# Altium schematic sheet 6V_buck.SchDoc
size A4; SheetNumber: 3; SheetTotal: 3
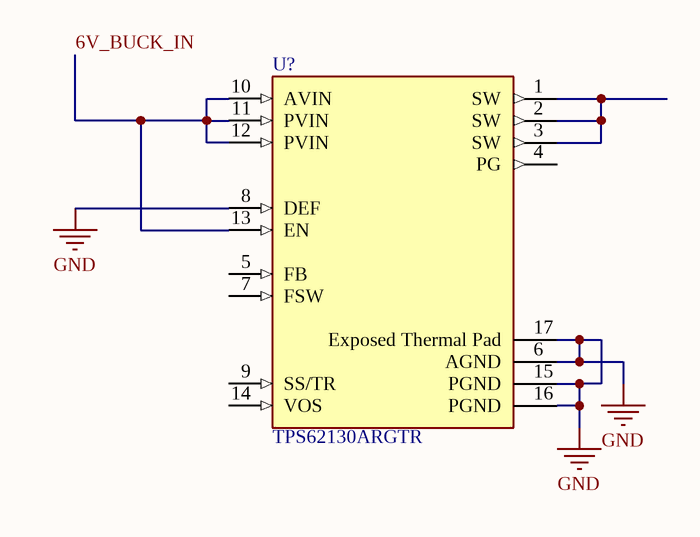
[diagram p0: 6V_buck.SchDoc]

## Parts
U?  TPS62130ARGTR  [FP-RGT0016C-MFG]

## Nets
GND: U?.6(AGND) U?.8(DEF) U?.15(PGND) U?.16(PGND) U?.17(Exposed_Thermal_Pad)
6V_BUCK_IN: U?.10(AVIN) U?.11(PVIN) U?.12(PVIN) U?.13(EN)
NetU?_1: U?.1(SW) U?.2(SW) U?.3(SW)

Not connected (* = marked no-connect by the designer): U? 4(PG) 5(FB) 7(FSW) 9(SS/TR) 14(VOS)

## Library data of the parts
U? = CMP-04918-000067-1: IC REG BUCK ADJUSTABLE 3A 16QFN; Manufacturer: Texas Instruments; Min Supply Voltage: 3V; Max Junction Temp: +125°C; Description: Conv DC-DC Single Step Down 3V to 17V 16-Pin VQFN EP T/R; Standoff Height: 0mm; Max Duty Cycle: 100%; Max Supply Voltage: 17V; Nominal Supply Current: 17uA; Number Of Outputs: 1; Output Type: AdjustableProgrammable; Switching Frequency: 1250-2500kHz; Output Voltage: 0.9-6V; Automotive: No; Height: 1mm; Device Class L2: Power Management ICs; Output Current: 3A; Digikey Description: IC REG BUCK ADJUSTABLE 3A 16QFN; Temperature: -40°C to +125°C; Temperature Range High: +125°C; Octopart: https://octopart.com/tps62130argtr-texas+instruments-29716940; Switching Topology: Buck; Lead Free: Yes; Temperature Range Low: -40°C; Category: IC; Mouser Description: 3-V to 17-V, 3-A step-down converter with DCS-control in 3x3 QFN package 16-VQFN -40 to 125; ComponentLink2URL: http://www.ti.com/lit/ds/symlink/tps62130a.pdf; Package: RGT0016C; Device Class L1: Integrated Circuits (ICs); RoHS: TRUE; Manufacturer Part Number: TPS62130ARGTR; Device Class L3: Voltage Regulators - Switching; ComponentLink2Description: Datasheet